# Altium schematic sheet 校正Z軸電路.SchDoc
size A4
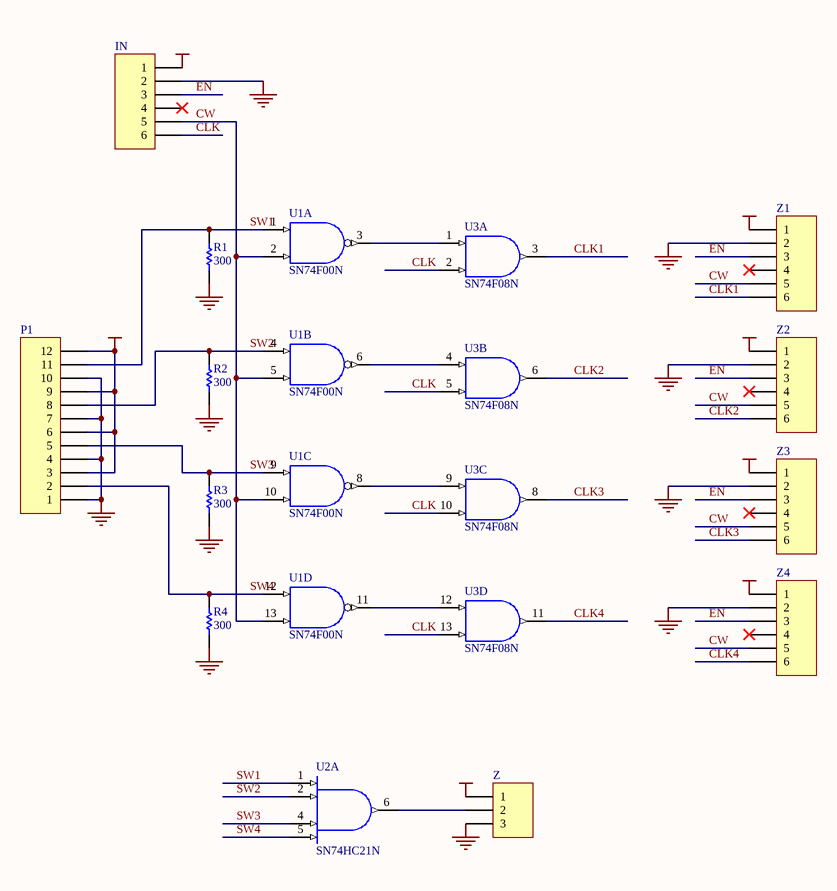
[diagram p0: 校正Z軸電路.SchDoc]

## Parts
IN  Header 6  [2.54mm 6pin]  (value not drawn)
P1  Header 12  [2.5mm 12pin]  (value not drawn)
R1  value 300  [AXIAL-0.3]  (hidden comment: Res1)
R2  value 300  [AXIAL-0.3]  (hidden comment: Res1)
R3  value 300  [AXIAL-0.3]  (hidden comment: Res1)
R4  value 300  [AXIAL-0.3]  (hidden comment: Res1)
U1  SN74F00N  [N014]  (parts A,B,C,D of 4)
U2  SN74HC21N  [N014]  (part A of 2)
U3  SN74F08N  [N014]  (parts A,B,C,D of 4)
Z  Header 3  [2.54mm 3pin]  (value not drawn)
Z1  Header 6  [2.54mm 6pin]  (value not drawn)
Z2  Header 6  [2.54mm 6pin]  (value not drawn)
Z3  Header 6  [2.54mm 6pin]  (value not drawn)
Z4  Header 6  [2.54mm 6pin]  (value not drawn)

## Nets
GND: IN.2 P1.1 P1.4 P1.7 P1.10 R1.1 R2.1 R3.1 R4.1 U1.7(GND) U2.7(GND) U3.7(GND) Z.3 Z1.2 Z2.2 Z3.2 Z4.2
VCC: IN.1 P1.3 P1.6 P1.9 P1.12 U1.14(VCC) U2.14(VCC) U3.14(VCC) Z.1 Z1.1 Z2.1 Z3.1 Z4.1
CLK: IN.6 U3.2(B) U3.5(B) U3.10(B) U3.13(B)
CLK1: U3.3(Y) Z1.6
CLK2: U3.6(Y) Z2.6
CLK3: U3.8(Y) Z3.6
CLK4: U3.11(Y) Z4.6
CW: IN.5 U1.2(B) U1.5(B) U1.10(B) U1.13(B) Z1.5 Z2.5 Z3.5 Z4.5
EN: IN.3 Z1.3 Z2.3 Z3.3 Z4.3
SW1: P1.11 R1.2 U1.1(A) U2.1(A)
SW2: P1.8 R2.2 U1.4(A) U2.2(B)
SW3: P1.5 R3.2 U1.9(A) U2.4(C)
SW4: P1.2 R4.2 U1.12(A) U2.5(D)
NetU1_3: U1.3(Y) U3.1(A)
NetU1_6: U1.6(Y) U3.4(A)
NetU1_8: U1.8(Y) U3.9(A)
NetU1_11: U1.11(Y) U3.12(A)
NetU2_6: U2.6(Y) Z.2

Not connected (* = marked no-connect by the designer): IN 4*; Z1 4*; Z2 4*; Z3 4*; Z4 4*

## Library data of the parts
IN Z1-Z4 = Header 6: Header, 6-Pin; LatestRevisionDate: 17-Jul-2002; LatestRevisionNote: Re-released for DXP Platform.; Publisher: Altium Limited
P1 = Header 12: Header, 12-Pin; LatestRevisionDate: 17-Jul-2002; LatestRevisionNote: Re-released for DXP Platform.; Publisher: Altium Limited
R1-R4 = Res1: Resistor; Published: 8-Jun-2000; LatestRevisionDate: 17-Jul-2002; LatestRevisionNote: Re-released for DXP Platform.; Publisher: Altium Limited
U1 = SN74F00N: Quadruple 2-Input Positive-NAND Gate; Published: 8-Jun-2000; LatestRevisionDate: 17-Jul-2002; LatestRevisionNote: Re-released for DXP Platform.; DatasheetDocument: Oct-1993; PackageDocument: Oct-1995; PackageReference: N014; Publisher: Altium Limited
U2 = SN74HC21N: Dual 4-Input Positive-AND Gate; Note: Pins 3 and 11 are not connected and not drawn; Published: 8-Jun-2000; LatestRevisionDate: 17-Jul-2002; LatestRevisionNote: Re-released for DXP Platform.; DatasheetDocument: May-1997; PackageDocument: Oct-1995; PackageReference: N014; Publisher: Altium Limited
U3 = SN74F08N: Quadruple 2-Input Positive-AND Gate; Published: 8-Jun-2000; LatestRevisionDate: 17-Jul-2002; LatestRevisionNote: Re-released for DXP Platform.; DatasheetDocument: Oct-1993; PackageDocument: Oct-1995; PackageReference: N014; Publisher: Altium Limited
Z = Header 3: Header, 3-Pin; LatestRevisionDate: 17-Jul-2002; LatestRevisionNote: Re-released for DXP Platform.; Publisher: Altium Limited